# Altium schematic sheet Copy of Output_Section.SchDoc
size A3; SheetNumber: 2; SheetTotal: 2
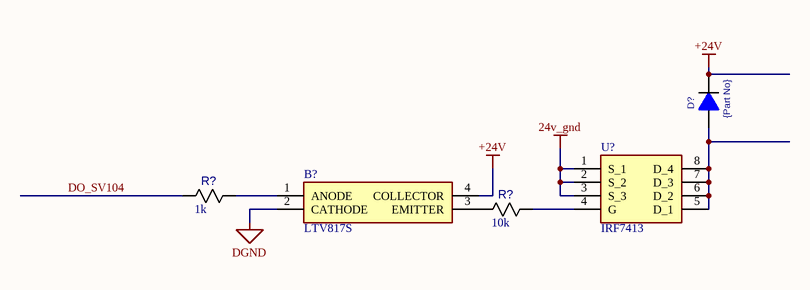
[diagram p0: Copy of Output_Section.SchDoc]

## Parts
(Parts that share a designator on the sheet are numbered #1, #2 ... from top to bottom, then left to right.)
B?  LTV817S  [SOP254P1016X460-4N]
D?  Part No.: {Part No}  [MINI-SMA]  (hidden comment: MINI-SMA)
R?#1  규격: 1k  [R1608N]  (hidden comment: R1608)
R?#2  규격: 10k  [R1608N]  (hidden comment: R1608)
U?  Part No.: IRF7413  [SOIC127P600X175-8N]  (hidden comment: FET_IRF7413)

## Nets
24v_gnd: U?.1(S_1) U?.2(S_2) U?.3(S_3)
+24V: B?.4(COLLECTOR) D?.2
DGND: B?.2(CATHODE)
DO_SV104: R?#1.1
NetB?_1: B?.1(ANODE) R?#1.2
NetB?_3: B?.3(EMITTER) R?#2.1
NetD?_1: D?.1 U?.5(D_1) U?.6(D_2) U?.7(D_3) U?.8(D_4)
NetR?#2_2: R?#2.2 U?.4(G)

## Library data of the parts
B? = LTV817S: 1 CHANNEL TRANSISTOR OUTPUT Photocoupler; Manufacturer_Name: Lite-On; Geometry.Height: 4.6mm; Manufacturer_Part_Number: LTV817S; Mouser Part Number: *; Mouser Price/Stock: *; Arrow Part Number: LTV817S; Arrow Price/Stock: https://www.arrow.com/en/products/ltv-817s/lite-on-technology; Datasheet Link: https://www.arrow.com/en/products/ltv-817s/lite-on-technology
R?#1 R?#2 = R1608: Part No.: {Part No}; Price: {Price}
U? = FET_IRF7413: Integrated Circuit; Manufacturer_Name: onsemi; Datasheet Link: https://www.onsemi.com/pub/Collateral/FDS9435A-D.PDF; Height: 1.75mm; Mouser Part Number: 512-FDS9435A; Mouser Price/Stock: https://www.mouser.co.uk/ProductDetail/onsemi-Fairchild/FDS9435A?qs=HK%252BeIG1iaai5iaQ4P2nZLA%3D%3D; Arrow Part Number: FDS9435A; Arrow Price/Stock: https://www.arrow.com/en/products/fds9435a/on-semiconductor?region=nac; Price: 570
D? = MINI-SMA: Price: {Price}